# EAGLE design ATmega64M1_Dev_Board (EAGLE 9.1.1)
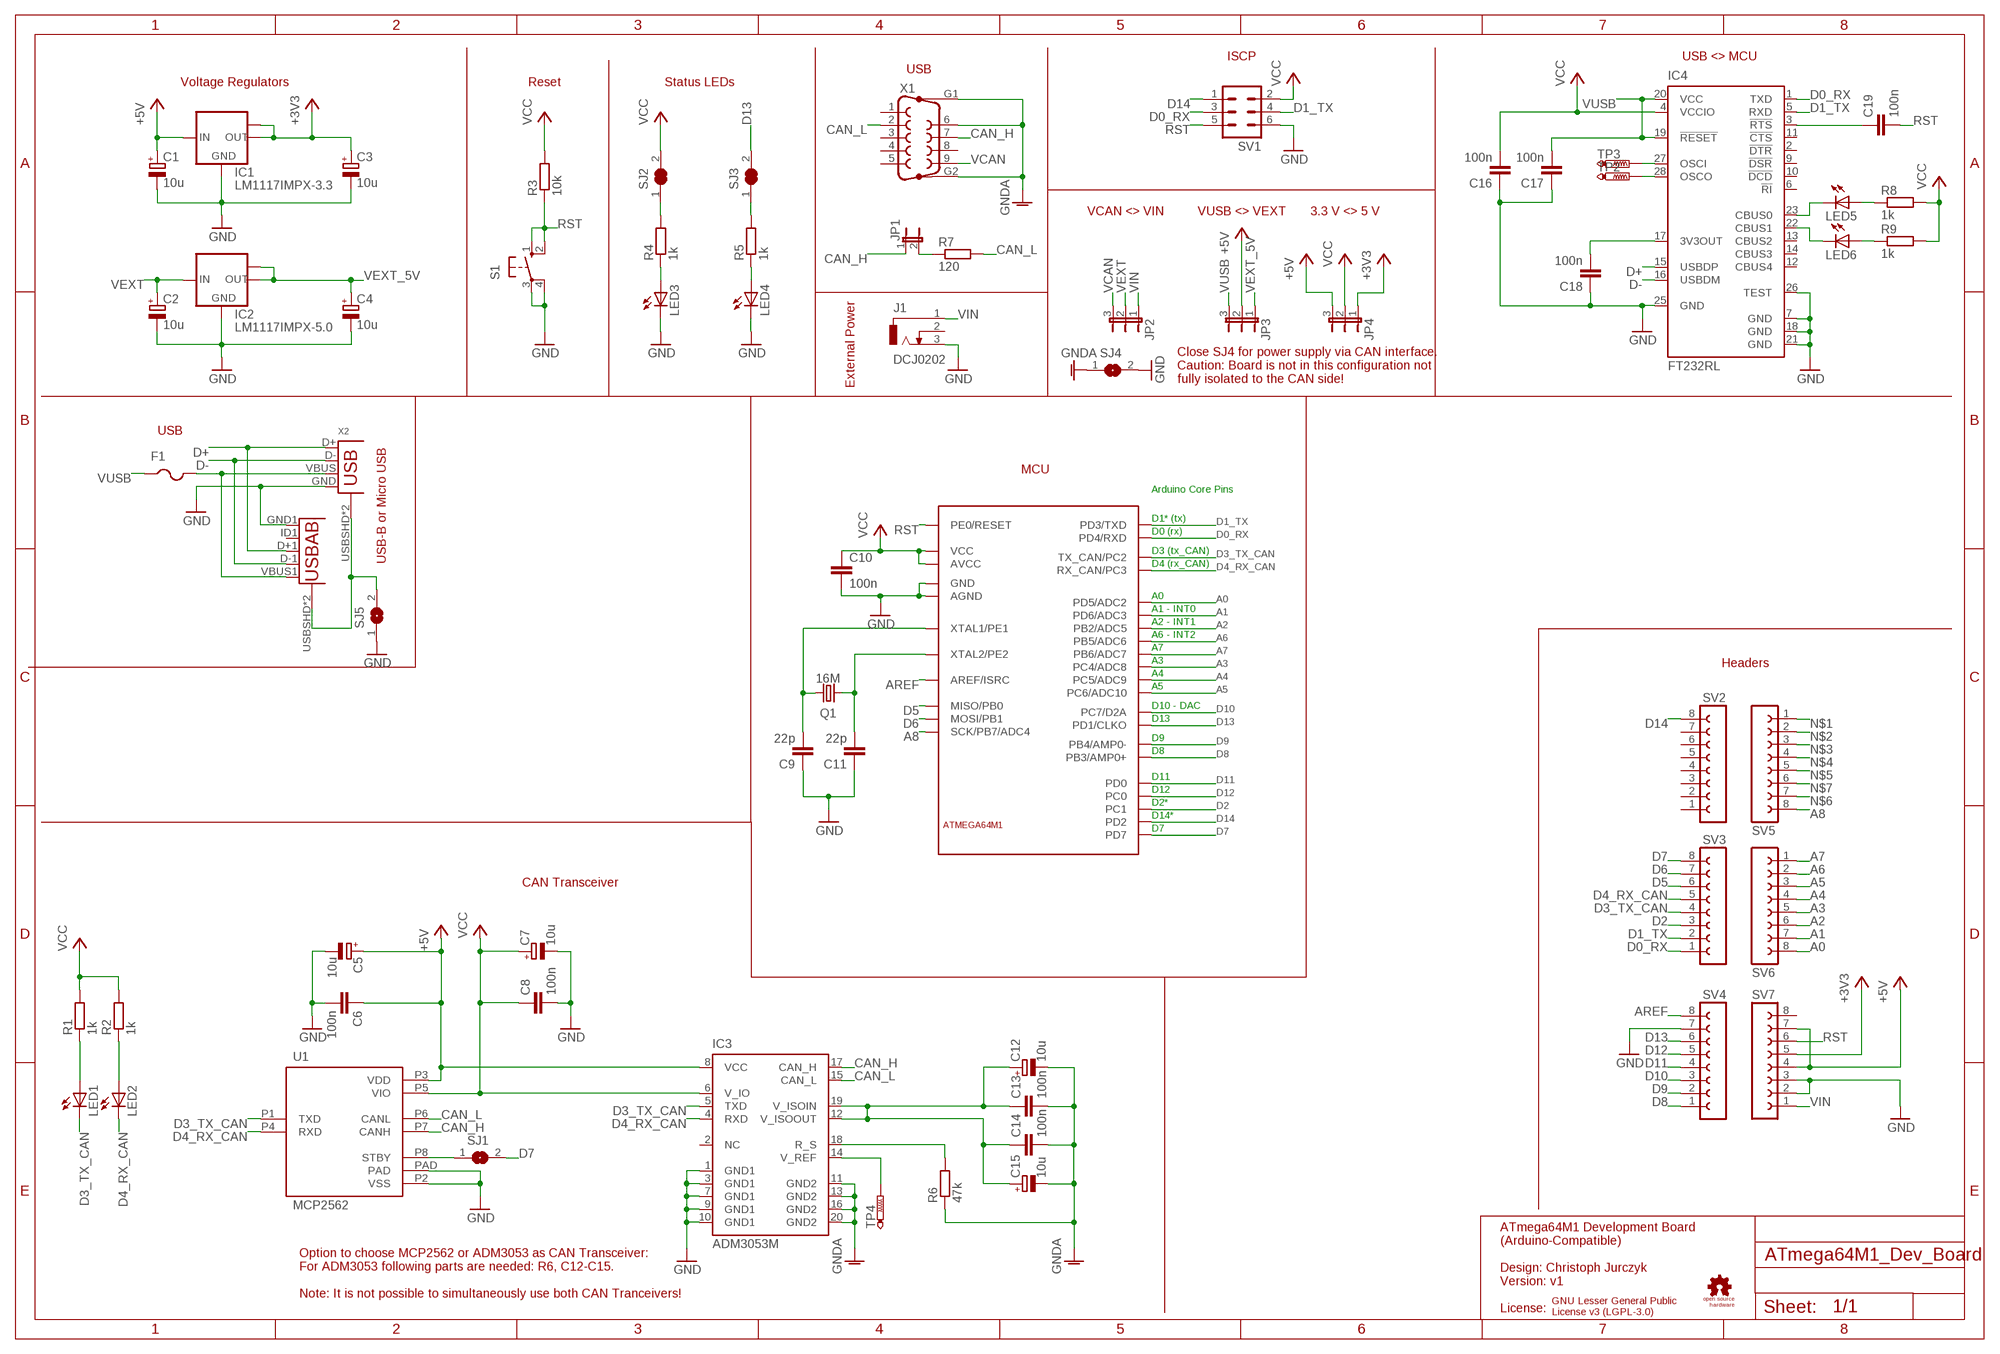
[diagram p0: schematic, sheet 1]

## Parts
C1  10u  CPOL-EUA/3216-18W  [A/3216-18W]
C2  10u  CPOL-EUA/3216-18W  [A/3216-18W]
C3  10u  CPOL-EUA/3216-18W  [A/3216-18W]
C4  10u  CPOL-EUA/3216-18W  [A/3216-18W]
C5  10u  CPOL-EUA/3216-18W  [A/3216-18W]
C6  100n  C-EUC0603  [C0603]
C7  10u  CPOL-EUA/3216-18W  [A/3216-18W]
C8  100n  C-EUC0603  [C0603]
C9  22p  C-EUC0603  [C0603]
C10  100n  C-EUC0603  [C0603]
C11  22p  C-EUC0603  [C0603]
C12  10u  CPOL-EUA/3216-18W  [A/3216-18W]
C13  100n  C-EUC0603  [C0603]
C14  100n  C-EUC0603  [C0603]
C15  10u  CPOL-EUA/3216-18W  [A/3216-18W]
C16  100n  C-EUC0603  [C0603]
C17  100n  C-EUC0603  [C0603]
C18  100n  C-EUC0603  [C0603]
C19  100n  C-EUC0603  [C0603]
F1  PTCFUSE-1206  [R1206]
GOLD_ORB_SM1  OSHWLOGOLOGO8MM  [OSHW_8MM]
IC1  LM1117IMPX-3.3  [SOT223]
IC2  LM1117IMPX-5.0  [SOT223]
IC3  ADM3053M  [SO20W]
IC4  FT232RL  [SSOP28]
IC11  ATMEGA64M1TQFP32  [QFP-32]
J1  DCJ0202  [DCJ0202]
JP1  JP1E  [JP1]
JP2  JP2E  [JP2]
JP3  JP2E  [JP2]
JP4  JP2E  [JP2]
LED1  LEDSML0805  [SML0805]
LED2  LEDSML0805  [SML0805]
LED3  LEDSML0805  [SML0805]
LED4  LEDSML0805  [SML0805]
LED5  LEDSML0805  [SML0805]
LED6  LEDSML0805  [SML0805]
Q1  16M  CRYSTALHC49S  [HC49/S]
R1  1k  R-EU_M0805  [M0805]
R2  1k  R-EU_M0805  [M0805]
R3  10k  R-EU_M0805  [M0805]
R4  1k  R-EU_M0805  [M0805]
R5  1k  R-EU_M0805  [M0805]
R6  47k  R-EU_M0805  [M0805]
R7  120  R-EU_M0805  [M0805]
R8  1k  R-EU_M0805  [M0805]
R9  1k  R-EU_M0805  [M0805]
S1  10-XX  [B3F-10XX]
SJ1  SJ  [SJ]
SJ2  SJ_NC  [SJ_NC]
SJ3  SJ_NC  [SJ_NC]
SJ4  SJ  [SJ]
SJ5  SJ  [SJ]
SV1  ML6  [ML6]
SV2  FE08-1  [FE08]
SV3  FE08-1  [FE08]
SV4  FE08-1  [FE08]
SV5  FE08-1  [FE08]
SV6  FE08-1  [FE08]
SV7  FE08-1  [FE08]
TP2  PTR1B1,27  [B1,27]
TP3  PTR1B1,27  [B1,27]
TP4  PTR1B1,27  [B1,27]
U1  MCP2562  [DFN3X3]
U2  USB  [USB-MICRO-SMD_WITHOUT_PASTE]
X1  F09HP  [F09HP]
X2  USB-B-H  [USB-B-H]

## Nets
+3V3: C3.+ IC1.2(OUT) IC1.TAB(OUT1) JP4.1 SV7.5
+5V: C1.+ C5.+ C6.1 IC1.3(IN) IC3.8(VCC) JP3.2 JP4.3 SV7.4 SV7.7 U1.P3(VDD)
A0: IC11.13(PD5/ADC2) SV6.8
A1: IC11.14(PD6/ADC3) SV6.7
A2: IC11.16(PB2/ADC5) SV6.6
A3: IC11.17(PC4/ADC8) SV6.5
A4: IC11.18(PC5/ADC9) SV6.4
A5: IC11.22(PC6/ADC10) SV6.3
A6: IC11.26(PB5/ADC6) SV6.2
A7: IC11.27(PB6/ADC7) SV6.1
A8: IC11.28(SCK/PB7/ADC4) SV5.8
AREF: IC11.21(AREF/ISRC) SV4.8
CAN_H: IC3.17(CAN_H) JP1.1 U1.P7(CANH) X1.7
CAN_L: IC3.15(CAN_L) R7.2 U1.P6(CANL) X1.2
D0_RX: IC4.1(TXD) IC11.12(PD4/RXD) SV1.3 SV3.1
D1_TX: IC4.5(RXD) IC11.2(PD3/TXD) SV1.4 SV3.2
D2: IC11.3(PC1) SV3.3
D3_TX_CAN: IC3.5(TXD) IC11.6(TX_CAN/PC2) LED1.C SV3.4 U1.P1(TXD)
D4_RX_CAN: IC3.4(RXD) IC11.7(RX_CAN/PC3) LED2.C SV3.5 U1.P4(RXD)
D5: IC11.8(MISO/PB0) SV3.6
D6: IC11.9(MOSI/PB1) SV3.7
D7: IC11.15(PD7) SJ1.2 SV3.8
D8: IC11.23(PB3/AMP0+) SV4.1
D9: IC11.24(PB4/AMP0-) SV4.2
D10: IC11.25(PC7/D2A) SV4.3
D11: IC11.29(PD0) SV4.4
D12: IC11.30(PC0) SV4.5
D13: IC11.32(PD1/CLKO) SJ3.2 SV4.6
D14: IC11.1(PD2) SV1.1 SV2.8
D+: IC4.15(USBDP) U2.D+1(D+) X2.D+
D-: IC4.16(USBDM) U2.D-1(D-) X2.D-
GND: C1.- C2.- C3.- C4.- C5.- C6.2 C7.- C8.2 C9.1 C10.2 C11.1 C16.1 C17.1 C18.1 IC1.1(GND) IC2.1(GND) IC3.1(GND1) IC3.3(GND1) IC3.7(GND1) IC3.9(GND1) IC3.10(GND1) IC4.7(GND) IC4.18(GND) IC4.21(GND) IC4.25(GND) IC4.26(TEST) IC11.5(GND) IC11.20(AGND) J1.3 LED3.C LED4.C S1.3(P) S1.4(P1) SJ4.2 SJ5.1 SV1.6 SV4.7 SV7.2 SV7.3 U1.P2(VSS) U1.PAD U2.GND1(GND) X2.GND
GNDA: C12.- C13.2 C14.2 C15.- IC3.11(GND2) IC3.13(GND2) IC3.16(GND2) IC3.20(GND2) R6.1 SJ4.1 X1.6 X1.G1 X1.G2
N$1: SV5.1
N$2: SV5.2
N$3: SV5.3
N$4: SV5.4
N$5: SV5.5
N$6: SV5.7
N$7: SV5.6
N$8: F1.2 U2.VBUS1(VBUS) X2.VBUS
N$9: SJ1.1 U1.P8(STBY)
N$10: C12.+ C13.1 C14.1 C15.+ IC3.12(V_ISOOUT) IC3.19(V_ISOIN)
N$11: IC4.27(OSCI) TP3.TP
N$12: C18.2 IC4.17(3V3OUT)
N$13: IC3.18(R_S) R6.2
N$14: IC4.28(OSCO) TP2.TP
N$15: C19.1 IC4.3(!RTS)
N$16: IC4.22(CBUS1) LED6.C
N$17: IC4.23(CBUS0) LED5.C
N$18: LED6.A R9.1
N$19: LED5.A R8.1
N$20: JP1.2 R7.1
N$21: LED3.A R4.1
N$22: LED4.A R5.1
N$23: LED2.A R2.1
N$24: LED1.A R1.1
N$25: IC3.14(V_REF) TP4.TP
N$26: R5.2 SJ3.1
N$27: R4.2 SJ2.1
N$28: SJ5.2 U2.USBSHD U2.USBSHD1(USBSHD) X2.USBSHD X2.USBSHD2(USBSHD)
RST: C19.2 IC11.31(PE0/RESET) R3.1 S1.1(S) S1.2(S1) SV1.5 SV7.6
VCAN: JP2.3 X1.9
VCC: C7.+ C8.1 C10.1 C16.2 IC3.6(V_IO) IC4.4(VCCIO) IC11.4(VCC) IC11.19(AVCC) JP4.2 R1.2 R2.2 R3.2 R8.2 R9.2 SJ2.2 SV1.2 U1.P5(VIO)
VEXT: C2.+ IC2.3(IN) JP2.2
VEXT_5V: C4.+ IC2.2(OUT) IC2.TAB(OUT1) JP3.1
VIN: J1.1 JP2.1 SV7.1
VUSB: C17.2 F1.1 IC4.19(!RESET) IC4.20(VCC) JP3.3
XTAL1: C9.2 IC11.10(XTAL1/PE1) Q1.2
XTAL2: C11.2 IC11.11(XTAL2/PE2) Q1.1
Unconnected: IC3.2(NC) IC4.2(!DTR) IC4.6(!RI) IC4.9(!DSR) IC4.10(!DCD) IC4.11(!CTS) IC4.12(CBUS4) IC4.13(CBUS2) IC4.14(CBUS3) J1.2 SV2.1 SV2.2 SV2.3 SV2.4 SV2.5 SV2.6 SV2.7 SV7.8 U2.ID1(USBID) X1.1 X1.3 X1.4 X1.5 X1.8

## Notes on the sheet
- ISCP | USB <> MCU
- USB
- Voltage Regulators | Reset | Status LEDs
- VCAN <> VIN | VUSB <> VEXT | 3.3 V <> 5 V
- External Power
- Close SJ4 for power supply via CAN interface.
  Caution: Board is not in this configuration not 
  fully isolated to the CAN side!
- USB
- MCU
- Arduino Core Pins
- D1* (tx)
- D0 (rx)
- D3 (tx_CAN)
- USB-B or Micro USB
- D4 (rx_CAN)
- A0
- A1 - INT0
- A2 - INT1
- A6 - INT2
- A7
- A3
- Headers
- A4
- A5
- D10 - DAC
- D13
- D9
- D8
- D11
- D12
- D2*
- D14*
- D7
- CAN Transceiver
- ATmega64M1 Development Board 
  (Arduino-Compatible)
  
  Design: Christoph Jurczyk
  Version: v1
  
  License:
- Option to choose MCP2562 or ADM3053 as CAN Transceiver:
  For ADM3053 following parts are needed: R6, C12-C15.
  
  Note: It is not possible to simultaneously use both CAN Tranceivers!
- GNU Lesser General Public 
  License v3 (LGPL-3.0)

## Library data of the parts
C1-C5 C7 C12 C15 = rcl:CPOL-EU: POLARIZED CAPACITOR, European symbol; SPICEPREFIX: C
C6 C8-C11 C13 C14 C16-C19 = rcl:C-EU: CAPACITOR, European symbol; SPICEPREFIX: C
F1 = adafruit:PTCFUSE: PTC fuses, resettable thermistors
GOLD_ORB_SM1 = oshw:OSHWLOGO: The OSHW logo for PCB layout
IC1 IC2 = lm1117:LM1117IMPX-*
IC3 = ADM3053:ADM3053: Signal and Power Isolated CAN Transceiver Analog Devices - Signal and Power Isolated CAN Transceiver with Integrated Isolated DC-to-DC Converter
IC4 = ftdichip:FT232R: Source: http://www.ftdichip.com/Documents/DataSheets/DS_FT232R_v104.pdf; MPN: FT232RL; OC_FARNELL: 1146032; OC_NEWARK: 91K9918
IC11 = ATmega64M1:ATMEGA64M1
J1 = con-jack:DCJ0202: DC POWER JACK Source: DCJ0202.pdf; OC_FARNELL: unknown; OC_NEWARK: unknown
JP1 = jumper:JP1E: JUMPER
JP2-JP4 = CJ_Library:JP2E: JUMPER
LED1-LED6 = led:LED: LED OSRAM: - CHIPLED LG R971, LG N971, LY N971, LG Q971, LY Q971, LO R971, LY R971 LH N974, LH R974 LS Q976, LO Q976, LY Q976 LO Q996 - Hyper CHIPLED LW Q18S LB Q993, LB Q99A, LB R99A - SideLED LS A670, LO A670, LY A670, LG A670, LP A670 LB A673, LV A673, LT A673, LW A673 LH A674 LY A675 LS A676, LA A676, LO A676, LY A676, LW A676 LS A679, LY A679, LG A679 - Hyper Micro SIDELED® LS Y876, LA Y876, LO Y876, LY Y876 LT Y87S - SmartLED LW L88C, LW L88S LB L89C, LB L89S, LG L890 LS L89K, LO L89K, LY L89K LS L896, LA L896, LO L896, LY L896 - TOPLED LS T670, LO T670, LY T670, LG T670, LP T670 LSG T670, LSP T670, LSY T670, LOP T670, LYG T670 LG T671, LOG T671, LSG T671 LB T673, LV T673, LT T673, LW T673 LH T674 LS T676, LA T676, LO T676, LY T676, LB T676, LH T676, LSB T676, LW T676 LB T67C, LV T67C, LT T67C, LS T67K, LO T67K, LY T67K, LW E67C LS E67B, LA E67B, LO E67B, LY E67B, LB E67C, LV E67C, LT E67C LW T67C LS T679, LY T679, LG T679 LS T770, LO T770, LY T770, LG T770, LP T770 LB T773, LV T773, LT T773, LW T773 LH T774 LS E675, LA E675, LY E675, LS T675 LS T776, LA T776, LO T776, LY T776, LB T776 LHGB T686 LT T68C, LB T68C - Hyper Mini TOPLED® LB M676 - Mini TOPLED Santana® LG M470 LS M47K, LO M47K, LY M47K Source: http://www.osram.convergy.de LUXEON: - LUMILED® LXK2-PW12-R00, LXK2-PW12-S00, LXK2-PW14-U00, LXK2-PW14-V00 LXK2-PM12-R00, LXK2-PM12-S00, LXK2-PM14-U00 LXK2-PE12-Q00, LXK2-PE12-R00, LXK2-PE12-S00, LXK2-PE14-T00, LXK2-PE14-U00 LXK2-PB12-K00, LXK2-PB12-L00, LXK2-PB12-M00, LXK2-PB14-N00, LXK2-PB14-P00, LXK2-PB14-Q00 LXK2-PR12-L00, LXK2-PR12-M00, LXK2-PR14-Q00, LXK2-PR14-R00 LXK2-PD12-Q00, LXK2-PD12-R00, LXK2-PD12-S00 LXK2-PH12-R00, LXK2-PH12-S00 LXK2-PL12-P00, LXK2-PL12-Q00, LXK2-PL12-R00 Source: www.luxeon.com KINGBRIGHT: KA-3528ASYC Source: www.kingbright.com
Q1 = crystal:CRYSTAL: CRYSTAL; OC_FARNELL: 1667008; OC_NEWARK: unknown
R1-R9 = rcl:R-EU_: RESISTOR, European symbol; SPICEPREFIX: R
S1 = switch-omron:10-XX: OMRON SWITCH; MPN: B3F-1000; OC_FARNELL: 176432; OC_NEWARK: 36M3542
SJ1 SJ4 SJ5 = jumper:SJ: SMD solder JUMPER
SJ2 SJ3 = CJ_Library:SJ_NC: SMD solder JUMPER
SV1 = con-harting-ml:ML6: HARTING; OC_FARNELL: unknown; OC_NEWARK: unknown
SV2-SV7 = CJ_Library:FE08-1: FEMALE HEADER; OC_FARNELL: unknown; OC_NEWARK: unknown
TP2-TP4 = testpad:PTR1: TEST PIN
U1 = can:MCP2562
U2 = MicroUSB:USB: This is a USB AB connector that is compatible with USB OTG. i.e. this connector can serve as a host or device
X1 = con-subd:F09HP: SUB-D; OC_FARNELL: unknown; OC_NEWARK: unknown
X2 = con-usb-3:USB: USB Connectors

## Board
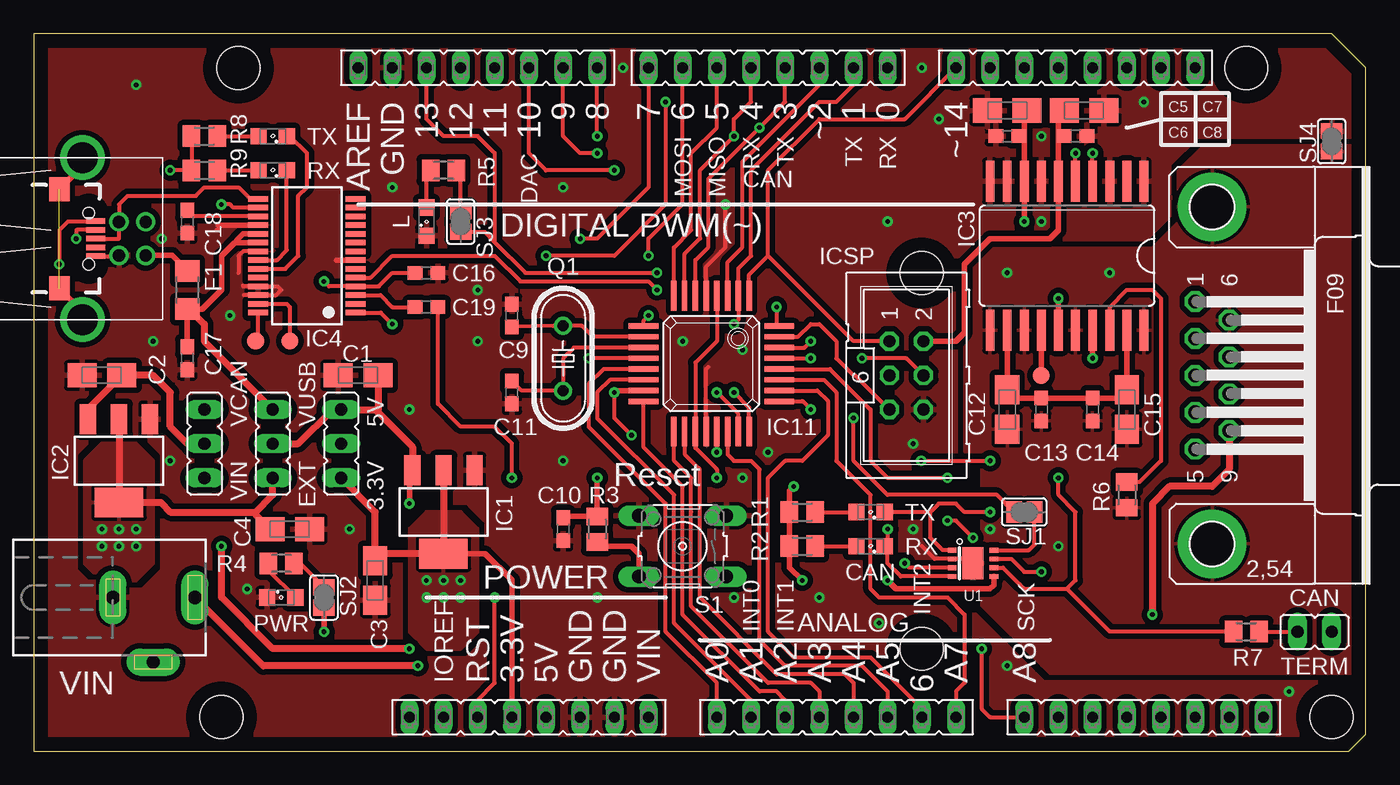
[diagram p1: board, top side]
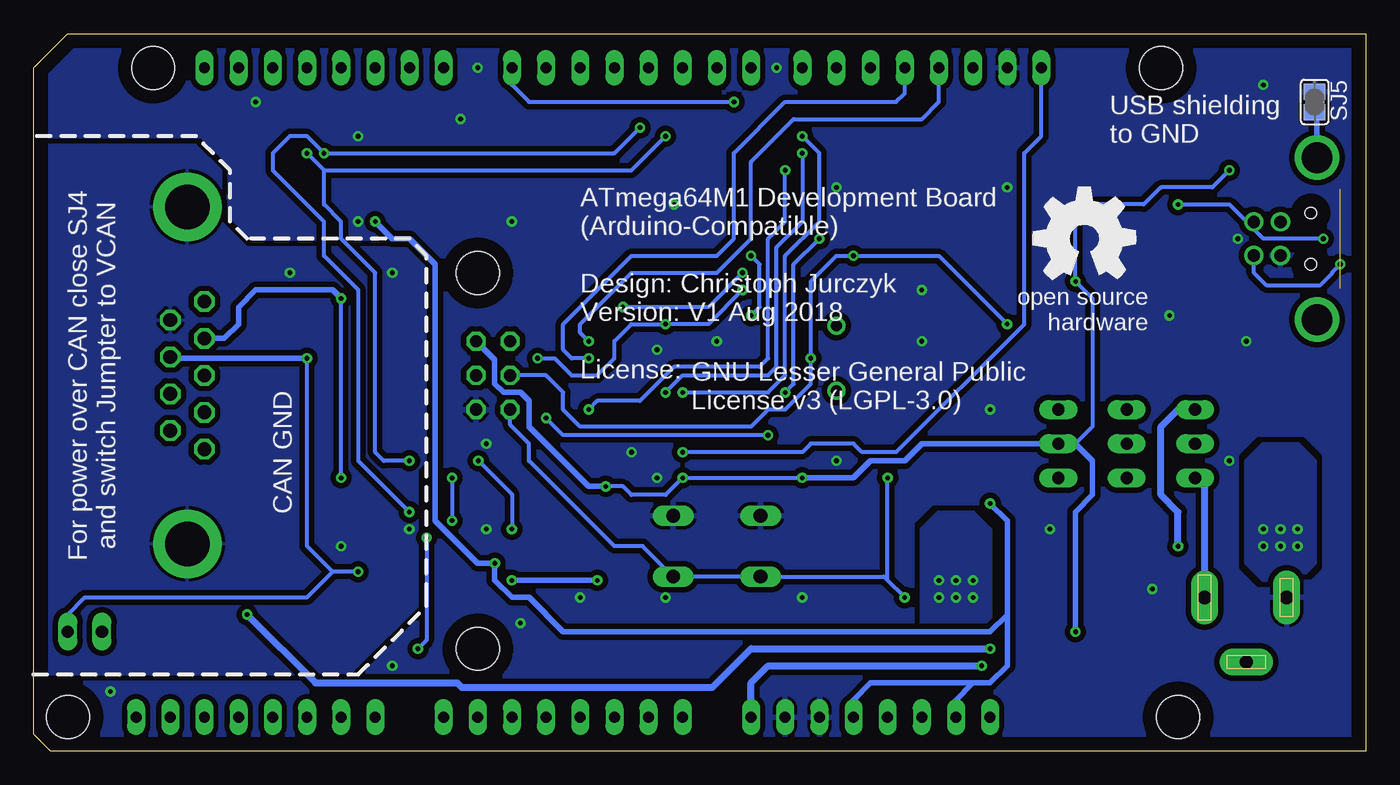
[diagram p2: board, bottom side, seen from below]

Size 99.06 x 53.34 mm. Coordinates in mm from the lower left corner, seen from the top.
Outline: 0,0 97.79,0 99.06,1.27 99.06,50.8 96.52,53.34 0,53.34 0,0
Copper layers (1*16): Top 0.035mm / dielectric 1.5mm / Bottom 0.035mm
Design rules "default *": minimum track width 6mil, minimum drill 0.35mm, track to track 3.5mil, track to pad 3.5mil, pad to pad 3.5mil, via to via 3.5mil, smd to smd 3.5mil, copper to edge 40mil, drill to drill 6mil, minimum pad ring 10mil, minimum via ring 8mil, stop-mask expansion 4mil, vias tented up to drill 13mil, thermal gap 10mil
Holes 3.2 mm at 90.17,50.8 96.52,2.54 66.04,35.56 66.04,7.62 15.24,50.8 13.97,2.54
tKeepout: area 12.2,47.8 to 18.2,53.8; area 11,-0.5 to 17,5.5; area 93.5,-0.5 to 99.5,5.5; area 87.2,47.8 to 93.2,53.8; area 63,32.6 to 69,38.6

### Footprints (pad centres in the part's own frame; a part is rotated, then mirrored left to right if it is on the bottom)
A/3216-18W = smd 2.15 x 1.8: + 1.475,0; - -1.475,0
C0603 = smd 1.1 x 1: 1 -0.85,0; 2 0.85,0
R1206 = smd 1.6 x 1.803: 1 -1.422,0; 2 1.422,0
SOT223 = smd 1.219 x 2.235: 1 -2.311,-3.099; 2 0,-3.099; 3 2.311,-3.099 | smd 3.6 x 2.2: TAB 0,3.099
SO20W = smd 0.66 x 3.032: 1 -5.715,-5.529; 2 -4.445,-5.529; 3 -3.175,-5.529; 4 -1.905,-5.529; 5 -0.635,-5.529; 6 0.635,-5.529; 7 1.905,-5.529; 8 3.175,-5.529; 9 4.445,-5.529; 10 5.715,-5.529; 11 5.715,5.529; 12 4.445,5.529; 13 3.175,5.529; 14 1.905,5.529; 15 0.635,5.529; 16 -0.635,5.529; 17 -1.905,5.529; 18 -3.175,5.529; 19 -4.445,5.529; 20 -5.715,5.529
SSOP28 = smd 0.4 x 1.5: 1 -4.225,-3.625; 2 -3.575,-3.625; 3 -2.925,-3.625; 4 -2.275,-3.625; 5 -1.625,-3.625; 6 -0.975,-3.625; 7 -0.325,-3.625; 8 0.325,-3.625; 9 0.975,-3.625; 10 1.625,-3.625; 11 2.275,-3.625; 12 2.925,-3.625; 13 3.575,-3.625; 14 4.225,-3.625; 15 4.225,3.625; 16 3.575,3.625; 17 2.925,3.625; 18 2.275,3.625; 19 1.625,3.625; 20 0.975,3.625; 21 0.325,3.625; 22 -0.325,3.625; 23 -0.975,3.625; 24 -1.625,3.625; 25 -2.275,3.625; 26 -2.925,3.625; 27 -3.575,3.625; 28 -4.225,3.625
QFP-32 = smd 0.4 x 2.2: 1 -2.4,-4.65; 2 -1.6,-4.65; 3 -0.8,-4.65; 4 0,-4.65; 5 0.8,-4.65; 6 1.6,-4.65; 7 2.4,-4.65; 8 3.2,-4.65; 17 3.2,5.45; 18 2.4,5.45; 19 1.6,5.45; 20 0.8,5.45; 21 0,5.45; 22 -0.8,5.45; 23 -1.6,5.45; 24 -2.4,5.45 | smd 2.2 x 0.4: 9 5.45,-2.4; 10 5.45,-1.6; 11 5.45,-0.8; 12 5.45,0; 13 5.45,0.8; 14 5.45,1.6; 15 5.45,2.4; 16 5.45,3.2; 25 -4.65,3.2; 26 -4.65,2.4; 27 -4.65,1.6; 28 -4.65,0.8; 29 -4.65,0; 30 -4.65,-0.8; 31 -4.65,-1.6; 32 -4.65,-2.4
DCJ0202 = drill 1 pad 2 long: 1 0,3.1; 2 4.8,0; 3 0,-3
JP1 = drill 0.914 long: 1 0,-1.27; 2 0,1.27
JP2 = drill 0.914 long: 1 -2.54,0; 2 0,0; 3 2.54,0
SML0805 = smd 1.2 x 1.2: A 1.05,0; C -1.05,0
HC49/S = drill 0.813: 1 -2.413,0; 2 2.413,0
M0805 = smd 1.3 x 1.6: 1 -0.95,0; 2 0.95,0
B3F-10XX = drill 1.016 long: 1 -3.251,2.261; 2 3.251,2.261; 3 -3.251,-2.261; 4 3.251,-2.261
SJ = smd 1.168 x 1.6: 1 -0.762,0; 2 0.762,0
SJ_NC = smd 1.168 x 1.6: 1 -0.762,0; 2 0.762,0
ML6 = drill 0.914 octagon: 1 -2.54,-1.27; 2 -2.54,1.27; 3 0,-1.27; 4 0,1.27; 5 2.54,-1.27; 6 2.54,1.27
FE08 = drill 0.813 long: 1 -8.89,0; 2 -6.35,0; 3 -3.81,0; 4 -1.27,0; 5 1.27,0; 6 3.81,0; 7 6.35,0; 8 8.89,0
B1,27 = smd 1.27 x 1.27: TP 0,0
DFN3X3 = smd 0.35 x 0.65: P1 -0.975,-1.55; P2 -0.325,-1.55; P3 0.325,-1.55; P4 0.975,-1.55; P5 0.975,1.55; P6 0.325,1.55; P7 -0.325,1.55; P8 -0.975,1.55 | smd 2.4 x 1.55: PAD 0,0
USB-MICRO-SMD_WITHOUT_PASTE = smd 1.4 x 0.4: D+1 2.7,0; D-1 2.7,0.65; GND1 2.7,-1.3; ID1 2.7,-0.65; VBUS1 2.7,1.3 | smd 1.524 x 1.778: USBSHD 0,3.683; USBSHD1 0,-3.683 | hole 0.85: 2.2,1.9; 2.2,-1.9
F09HP = drill 1.016 octagon: 1 -5.486,-1.27; 2 -2.743,-1.27; 3 0,-1.27; 4 2.743,-1.27; 5 5.486,-1.27; 6 -4.115,1.27; 7 -1.372,1.27; 8 1.372,1.27; 9 4.115,1.27 | drill 3.302 pad 5.08: G1 -12.522,0; G2 12.522,0
USB-B-H = drill 0.914: D+ 0,1.25; D- 1.981,1.25; GND 0,-1.25; VBUS 1.981,-1.25 | drill 2.286: USBSHD -2.718,6.02; USBSHD2 -2.718,-6.02

### Placement (x,y rotation side)
C1  24.13,27.94 0 top
C2  5.08,27.94 0 top
C3  25.4,12.7 90 top
C4  19.05,16.51 180 top
C5  72.39,47.62 0 top
C6  72.39,45.72 180 top
C7  78.11,47.62 180 top
C8  77.47,45.72 0 top
C9  35.56,32.38 270 top
C10  39.37,16.51 270 top
C11  35.56,26.67 90 top
C12  72.39,25.4 90 top
C13  74.93,25.4 270 top
C14  78.74,25.4 270 top
C15  81.28,25.4 90 top
C16  29.21,35.56 180 top
C17  11.43,29.21 90 top
C18  11.43,39.37 90 top
C19  29.21,33.02 0 top
F1  11.43,34.29 90 top
GOLD_ORB_SM1  20.95,38.1 0 bottom
IC1  30.48,17.78 180 top
IC2  6.35,21.59 180 top
IC3  76.83,36.83 180 top
IC4  20.32,36.83 90 top
IC11  50.8,29.21 180 top
J1  8.89,11.43 270 top
JP1  95.25,8.89 90 top
JP2  12.7,22.86 90 top
JP3  17.78,22.86 90 top
JP4  22.86,22.86 90 top
LED1  62.23,17.78 180 top
LED2  62.23,15.24 180 top
LED3  18.41,11.43 0 top
LED4  29.21,39.37 90 top
LED5  17.78,45.72 180 top
LED6  17.78,43.18 180 top
Q1  39.37,29.21 90 top
R1  57.15,17.78 180 top
R2  57.15,15.24 180 top
R3  41.91,16.51 90 top
R4  18.41,13.97 0 top
R5  30.48,43.18 0 top
R6  81.28,19.05 90 top
R7  90.17,8.89 180 top
R8  12.7,45.72 180 top
R9  12.7,43.18 180 top
S1  48.26,15.24 180 top
SJ1  73.66,17.78 180 top
SJ2  21.59,11.43 270 top
SJ3  31.75,39.37 270 top
SJ4  96.52,45.34 90 top
SJ5  3.81,48.26 270 bottom
SV1  64.9,27.94 270 top
SV2  77.47,50.8 180 top
SV3  54.61,50.8 180 top
SV4  33.02,50.8 180 top
SV5  82.55,2.54 180 top
SV6  59.69,2.54 180 top
SV7  36.83,2.54 180 top
TP2  16.51,30.48 0 top
TP3  19.05,30.48 0 top
TP4  74.93,27.94 0 top
U1  69.85,13.97 270 top
U2  1.91,38.1 0 top
X1  87.63,27.94 270 top
X2  6.35,38.1 0 top

### Tracks (layer width: path | path; a pad name or v marks a point on that pad's centre or on a via)
+3V3  (via drill 0.35)
  Top 0.406: SV7.5 35.56,12.7 33.58,14.68 IC1.TAB
  Top 0.508: IC1.2 IC1.TAB 25.91,14.68 C3.+ 25.4,17.78 JP4.1
  other vias: 29.21,12.7 30.48,12.7 31.75,12.7 31.75,11.43 30.48,11.43 29.21,11.43
  pour Top (isolate 0.406): 27.94,16.51 27.94,8.89 29.21,7.62 31.75,7.62 33.02,8.89 33.02,16.51 31.75,17.78 29.21,17.78
  pour Bottom (isolate 0.406): 27.94,16.51 27.94,8.89 29.21,7.62 31.75,7.62 33.02,8.89 33.02,16.51 31.75,17.78 29.21,17.78
+5V  (via drill 0.35)
  Top 0.305: U1.P3 65.09,13.64 v64.77,13.97
  Top 0.406: 73.66,45.72 IC3.8 v73.66,39.37 | 73.66,45.72 73.66,47.42 C5.+ | C6.1 73.66,45.72 | v27.94,18.41 27.94,20.65 IC1.3
  Top 0.508: JP3.2 19.68,22.86 22.23,25.4 JP4.3 25.4,25.4 25.61,25.2 | IC1.3 28.17,22.63 25.61,25.2 | C1.+ 25.61,25.2
  Bottom 0.406: SV7.4 38.1,3.81 36.83,5.08 29.21,5.08 | 26.67,10.16 26.67,17.14 v27.94,18.41 | v73.66,39.37 72.39,38.1 71.12,38.1 69.22,36.2 69.22,17.14 66.04,13.97 v64.77,13.97 64.77,12.7 63.5,11.43 62.23,11.43 59.69,8.89 27.94,8.89 26.67,10.16 | 29.21,5.08 27.94,5.08 26.67,6.35 26.67,10.16 | SV7.7 30.48,3.81 29.21,5.08
A0
  Top 0.305: SV6.8 50.8,5.08 46.99,8.89 46.99,18.41 41.27,24.13 41.27,27.3 42.38,28.41 IC11.13
A1
  Top 0.305: SV6.7 53.34,3.81 47.62,9.53 47.62,19.05 41.91,24.77 41.91,26.67 42.85,27.61 IC11.14
A2
  Top 0.305: SV6.6 55.88,3.81 55.24,4.45 53.98,4.45 48.26,10.16 48.26,19.68 45.35,22.59 IC11.16
A3
  Top 0.305: SV6.5 58.42,4.45 57.78,5.08 54.61,5.08 48.9,10.79 48.9,17.78 48.9,20.32 47.62,21.59 47.62,23.73 IC11.17
A4
  Top 0.305: SV6.4 60.96,5.08 60.33,5.71 55.24,5.71 49.53,11.43 49.53,20.95 49.21,21.27 48.9,21.59 48.4,22.09 IC11.18
A5
  Top 0.305: SV6.3 63.5,4.45 61.59,6.35 55.88,6.35 53.98,8.26 53.98,20.95 53.34,21.59 52.07,21.59 51.6,22.06 IC11.22
A6
  Top 0.305: SV6.2 66.04,3.17 62.23,6.99 56.52,6.99 54.61,8.89 54.61,20.32 55.88,21.59 57.15,21.59 59.05,23.5 59.05,26.04 58.28,26.81 IC11.26
A7
  Top 0.305: SV6.1 68.58,4.45 69.22,5.08 69.22,10.16 67.94,11.43 62.87,11.43 62.23,12.06 62.23,19.05 59.69,21.59 59.69,26.67 58.75,27.61 IC11.27
A8  (via drill 0.35)
  Top 0.305: v67.94,17.14 68.58,17.14 v69.85,15.88 | v70.48,7.62 70.48,3.17 71.12,2.54 SV5.8 | IC11.28 59.22,28.41 62.23,25.4 62.23,21.59 63.5,20.32 v67.94,20.32
  Bottom 0.305: v70.48,7.62 69.85,8.26 v69.85,15.88 | v67.94,20.32 v67.94,17.14
AREF  (via drill 0.35)
  Top 0.305: v50.8,22.23 IC11.21
  Bottom 0.305: SV4.8 24.13,45.72 25.4,44.45 25.4,31.75 34.92,22.23 37.47,22.23 38.1,22.86 41.27,22.86 41.91,22.23 v50.8,22.23
CAN_H  (via drill 0.35)
  Top 0.305: U1.P7 72.7,14.29 73.66,13.34 v74.93,13.34
  Top 0.406: IC3.17 v78.74,29.21
  Bottom 0.305: v74.93,13.34 76.83,13.34 | v78.74,29.21 78.74,15.24 76.83,13.34 | JP1.1 96.52,10.16 95.25,11.43 78.74,11.43 76.83,13.34
  Bottom 0.406: v78.74,29.21 88.8,29.21 X1.7
CAN_L  (via drill 0.35)
  Top 0.305: U1.P6 72.08,13.64 73.34,12.38 73.66,12.06 76.83,12.06 | 76.83,12.06 77.47,12.7 77.47,17.78 76.2,19.05 v76.2,20.32 | R7.2 80.01,8.89 76.83,12.06
  Top 0.406: IC3.15 v76.2,33.66
  Bottom 0.305: v76.2,20.32 v76.2,33.66
  Bottom 0.406: v76.2,33.66 76.83,34.29 78.74,34.29 82.55,34.29 83.82,33.02 83.82,31.75 84.89,30.68 X1.2
D0_RX  (via drill 0.35)
  Top 0.305: v46.99,48.26 46.99,40.64 43.18,36.83 v38.1,36.83 | IC4.1 25.82,32.6 v26.67,31.75 | IC11.12 v41.27,29.21
  Bottom 0.305: SV3.1 63.5,49.53 62.23,48.26 v46.99,48.26 | v26.67,31.75 31.75,36.83 v38.1,36.83 39.37,36.83 41.27,34.92 v41.27,29.21 41.27,27.3 43.18,25.4 44.45,25.4 45.72,24.13 58.42,24.13 59.69,25.4 59.69,26.67 60.96,27.94 SV1.3
D1_TX  (via drill 0.35)
  Top 0.305: SV3.2 60.96,49.53 59.69,48.26 58.42,48.26 53.34,43.18 53.34,36.83 52.4,35.89 IC11.2 52.4,32.08 v52.07,31.75 | IC4.5 25.05,35.2 26.67,36.83 34.29,36.83 36.2,34.92 45.72,34.92 v46.35,34.29 | SV1.4 64.9,29.21 v61.59,29.21
  Bottom 0.305: v46.35,34.29 48.9,31.75 v52.07,31.75 54.61,31.75 55.88,30.48 55.88,29.21 57.15,27.94 59.05,27.94 60.33,29.21 v61.59,29.21
D2
  Top 0.305: SV3.3 58.42,49.53 52.7,43.81 52.7,37.47 51.6,36.36 IC11.3
D3_TX_CAN  (via drill 0.35)
  Top 0.305: U1.P1 67.61,14.95 66.67,15.88 66.67,17.78 | SV3.4 55.88,48.26 v53.98,46.35 50.16,42.55 50.16,37.47 49.2,36.5 IC11.6 | IC3.5 v77.47,44.45 | v71.12,17.78 69.22,17.78 68.58,18.41 67.31,18.41 66.67,17.78 | 66.67,17.78 LED1.C
  Bottom 0.305: v71.12,17.78 74.93,21.59 74.93,34.29 77.47,36.83 77.47,39.37 81.28,43.18 81.28,44.45 80.01,45.72 78.74,45.72 v77.47,44.45 55.88,44.45 v53.98,46.35
D4_RX_CAN  (via drill 0.35)
  Top 0.305: 63.5,15.24 LED2.C | IC3.4 v78.74,44.45 | v65.99,21.59 v71.12,21.59 | U1.P4 64.47,12.99 63.5,13.97 63.5,15.24 | v63.5,16.51 63.5,15.24 | IC11.7 48.4,36.97 49.55,38.12 49.55,43.2 v52.07,45.72 52.07,46.99 53.34,48.26 SV3.5
  Bottom 0.305: v78.74,44.45 77.47,43.18 | 77.47,43.18 54.61,43.18 v52.07,45.72 | v71.12,21.59 73.03,21.59 73.66,22.23 73.66,35.56 76.2,38.1 76.2,39.37 77.47,40.64 77.47,43.18 | v65.99,21.59 63.5,19.1 v63.5,16.51
D5
  Top 0.305: SV3.6 50.8,46.35 48.9,44.45 48.9,38.73 47.6,37.44 IC11.8
D6  (via drill 0.35)
  Top 0.305: IC11.9 45.35,32.02 v45.72,32.38 | v45.72,36.83 45.72,38.1 48.26,40.64 SV3.7
  Bottom 0.305: v45.72,32.38 45.09,33.02 45.09,36.2 v45.72,36.83
D7  (via drill 0.35)
  Top 0.305: SV3.8 45.72,41.91 41.91,38.1 v40.64,38.1 | SJ1.2 71.63,19.05 63.5,19.05 60.96,21.59 v60.96,24.77 | v44.45,23.5 43.18,24.77 v43.18,26.67
  Top 0.406: IC11.15 43.32,26.81 v43.18,26.67
  Bottom 0.305: v40.64,38.1 42.55,36.2 42.55,27.3 v43.18,26.67 | v60.96,24.77 59.69,23.5 v44.45,23.5
D8  (via drill 0.35)
  Top 0.305: v41.91,45.72 SV4.1 | IC11.23 52.4,25.07 v50.8,26.67
  Bottom 0.305: v41.91,45.72 40.64,44.45 40.64,39.37 43.18,36.83 43.18,27.94 44.45,26.67 v50.8,26.67
D9  (via drill 0.35)
  Top 0.305: v41.91,44.45 40.64,44.45 39.37,45.72 SV4.2 | IC11.24 53.2,25.54 v52.07,26.67
  Bottom 0.305: v41.91,44.45 41.91,39.37 43.81,37.47 43.81,28.57 44.45,27.94 50.8,27.94 v52.07,26.67
D10  (via drill 0.35)
  Top 0.305: v43.18,43.18 38.1,43.18 36.83,44.45 SV4.3 | IC11.25 57.12,26.01 57.15,26.04 v57.78,25.4
  Bottom 0.305: v43.18,43.18 43.18,39.37 44.45,38.1 44.45,29.21 45.09,28.57 51.44,28.57 53.98,26.04 57.15,26.04 v57.78,25.4
D11  (via drill 0.35)
  Top 0.305: IC11.29 v57.78,29.21
  Bottom 0.305: SV4.4 34.29,48.9 34.92,48.26 43.18,48.26 46.99,44.45 46.99,38.1 48.26,36.83 54.61,36.83 59.69,31.75 59.69,29.84 59.05,29.21 v57.78,29.21
D12  (via drill 0.35)
  Top 0.305: IC11.30 57.31,30.01 v57.78,30.48
  Bottom 0.305: SV4.5 31.75,48.26 33.02,46.99 42.55,46.99 45.72,43.81 45.72,38.1 48.26,35.56 54.61,35.56 58.42,31.75 58.42,31.11 v57.78,30.48
D13  (via drill 0.35)
  Top 0.305: SJ3.2 33.53,38.61 34.29,37.85 | SV4.6 29.21,46.99 30.48,45.72 33.02,45.72 34.29,44.45 34.29,37.85 | 34.29,37.85 36.58,35.56 v46.35,35.56 | v55.24,33.02 55.24,31.82 IC11.32
  Bottom 0.305: v46.35,35.56 48.9,33.02 v55.24,33.02
D14
  Top 0.305: IC11.1 53.2,35.42 54.61,36.83 | 54.61,36.83 54.61,43.18 58.42,46.99 64.77,46.99 SV2.8 | SV1.1 60.96,30.48 54.61,36.83
D+
  Top 0.305: 6.35,39.37 6.35,40.64 6.99,41.27 12.06,41.27 12.7,41.91 15.24,41.91 16.09,41.05 IC4.15 | 6.35,39.37 X2.D+ | U2.D+1 6.35,38.1 6.35,39.37
D-  (via drill 0.35)
  Top 0.305: IC4.16 14.84,40.41 14.61,40.64 v13.97,40.64 | U2.D-1 3.19,38.75 3.17,38.73 v3.17,38.1
  Bottom 0.305: v13.97,40.64 10.16,40.64 8.87,39.35 X2.D- 8.33,38.81 7.62,38.1 v3.17,38.1
GND  (via drill 0.35)
  Top 0.305: U1.PAD 69.53,14.29 U1.P2 66.98,14.29 66.04,15.24 | v51.44,40.64 51.44,37.48 51.09,37.13 51.09,37.12 50,36.03 IC11.5 | IC4.21 15.56,37.16 15.24,36.83 15.24,35.56 | 15.56,34.61 15.61,34.55 IC4.25 18.15,34.55 18.41,34.29 18.03,33.91 IC4.26 15.62,33.91 | 13.97,39.1 13.6,38.73 | U2.GND1 6.3,36.8 X2.GND | IC11.20 50,28.41 50.16,28.57
  Top 0.406: IC4.18 13.97,39.1 13.71,39.1 | IC4.7 22.54,36.51
  other vias: 58.42,11.43 66.04,50.8 39.37,41.91 41.91,11.43 67.31,46.99 82.55,48.26 63.5,39.37 65.41,16.51 26.67,41.91 33.02,34.29 43.81,50.8 39.37,21.59 27.94,25.4 74.93,45.72 74.93,39.37 15.88,12.06 23.5,16.51 10.16,21.59 8.89,30.48 14.61,32.38 9.53,38.1 52.07,11.43 72.39,6.35 93.34,4.45 7.62,49.53 54.61,22.23 52.7,29.84 48.26,30.48 33.02,30.48 62.87,9.53 65.41,22.86 52.7,20.32
  pour Top (isolate 0.406, rank 2): 0,0 97.79,0 99.06,1.27 99.06,50.8 96.52,53.34 95.25,53.34 0,53.34
  pour Bottom (isolate 0.406, rank 2): 0,0 97.79,0 99.06,1.27 99.06,50.8 96.52,53.34 95.25,53.34 0,53.34
GNDA  (via drill 0.35)
  other vias: 71.12,16.51 76.2,15.24 72.39,35.56 80.01,35.56
  pour Top (isolate 0.406): 99.06,5.71 75.56,5.71 74.93,6.35 70.48,10.79 70.48,20.32 70.48,20.95 69.22,22.23 69.22,36.2 70.48,37.47 83.19,37.47 85.09,39.37 85.09,43.18 87,45.09 99.06,45.09
  pour Bottom (isolate 0.406): 99.06,5.71 75.56,5.71 74.93,6.35 70.48,10.79 70.48,20.32 70.48,20.95 69.22,22.23 69.22,36.2 70.48,37.47 83.19,37.47 85.09,39.37 85.09,43.18 87,45.09 99.06,45.09
N$8  (via drill 0.35)
  Top 0.305: U2.VBUS1 4.58,39.37 2.54,39.37 1.91,38.73 v1.91,36.2
  Top 0.406: X2.VBUS 10.29,36.85 F1.2
  Bottom 0.305: v1.91,36.2 2.51,35.59 2.51,35.54 3.44,34.61 7.36,34.61 8.33,35.58 X2.VBUS
N$9
  Top 0.305: U1.P8 74,14.95 74.42,15.37 SJ1.1
N$10
  Top 0.406: IC3.12 72.39,27.94 C12.+ 73.02,26.25 C13.1 C14.1 80.66,26.25 C15.+ 81.28,27.94 IC3.19
N$11
  Top 0.305: IC4.27 18.82,33.26 19.05,33.02 TP3.TP
N$12
  Top 0.305: IC4.17 11.89,39.76 11.54,40.11 C18.2
N$13
  Top 0.305: IC3.18 80.01,33.02 81.28,34.29 83.19,34.29 83.82,33.66 83.82,21.59 82.23,20 R6.2
N$14
  Top 0.305: TP2.TP 16.7,30.66 IC4.28
N$15
  Top 0.305: IC4.3 25.79,33.91 26.67,33.02 C19.1
N$16
  Top 0.305: IC4.22 18.09,36.51 18.83,37.24 LED6.C
N$17
  Top 0.305: IC4.23 18.71,35.85 19.68,36.83 19.68,41.27 20.32,41.91 | 20.32,41.91 | 20.32,41.91 | 20.32,41.91 | 20.32,41.91 20.32,44.45 19.05,45.72 LED5.C
N$18
  Top 0.305: R9.1 LED6.A
N$19
  Top 0.305: R8.1 15.24,45.72 LED5.A
N$20
  Top 0.305: R7.1 JP1.2
N$21
  Top 0.305: LED3.A 17.46,13.43 R4.1
N$22
  Top 0.305: LED4.A 29.21,42.86 R5.1
N$23
  Top 0.305: R2.1 LED2.A
N$24
  Top 0.305: R1.1 LED1.A
N$25
  Top 0.406: IC3.14 TP4.TP
N$26
  Top 0.305: SJ3.1 31.75,42.86 R5.2
N$27
  Top 0.305: SJ2.1 19.81,13.97 R4.2
N$28  (1 unrouted)
  Top 0.406: U2.USBSHD 3.63,43.51 X2.USBSHD | U2.USBSHD1 3.63,32.69 X2.USBSHD2
  Bottom 0.406: SJ5.2 3.63,47.32 X2.USBSHD
RST  (via drill 0.35)
  Top 0.305: SV7.6 33.02,3.81 34.29,5.08 v34.29,11.43 | v35.56,20.32 35.56,22.86 34.29,24.13 31.75,24.13 30.06,25.82 C19.2 | IC11.31 56.84,30.81 57.78,31.75 58.42,31.75 59.69,30.48 59.69,29.21 60.96,27.94 61.09,27.94 SV1.5
  Top 0.406: R3.1 42.23,15.24 44.45,15.24 45.01,14.68 S1.2
  Bottom 0.305: 35.56,12.7 v35.56,20.32 | v34.29,11.43 35.56,12.7 | 35.56,12.7 35.84,12.98 S1.2 S1.1 53.77,15.24 55.88,15.24 62.23,21.59 62.23,22.86 63.63,24.26 SV1.5
VCAN  (via drill 0.35)
  Top 0.508: X1.9 88.9,20.95 87.63,19.68 84.45,19.68 83.19,18.41 v83.19,10.16 | v27.94,7.62 17.78,7.62 13.97,11.43 v13.97,15.24
  Bottom 0.508: v83.19,10.16 78.11,5.08 67.56,5.08 67.23,4.75 48.59,4.75 45.72,7.62 v27.94,7.62 | v13.97,15.24 13.97,17.78 15.24,19.05 15.24,24.13 13.97,25.4 JP2.3
VCC  (via drill 0.35)
  Top 0.305: C16.2 26.67,35.56 25.66,34.55 IC4.4 21.96,34.55 v21.59,34.92 | R8.2 R9.2 v10.16,43.18 | v50.8,20.32 50.8,20.95 49.2,22.55 IC11.19 49.2,28.88 50.8,30.48 IC11.4
  Top 0.406: 76.2,45.72 IC3.6 76.2,38.73 75.56,38.1 71.12,38.1 69.22,36.2 69.22,31.11 68.58,30.48 SV1.2 | 76.2,45.72 76.2,47.2 C7.+ | C8.1 76.2,45.72 | SJ2.2 v21.59,8.89 | U1.P5 71.4,12.35 71.12,12.06 64.14,12.06 v63.5,12.7 | v57.15,12.7 56.2,13.65 R2.2 R1.2 56.2,19.37 v56.52,19.68 | C10.1 39.47,17.46 R3.2 v41.91,20.32
  Bottom 0.305: v10.16,43.18 11.43,41.91 15.24,41.91 16.51,40.64 20.32,40.64 21.59,39.37 v21.59,34.92 20.32,33.66 20.32,24.13 21.59,22.86 | v41.91,20.32 v50.8,20.32 52.07,19.05 54.61,19.05 55.24,19.68 v56.52,19.68
  Bottom 0.406: v21.59,8.89 21.59,17.78 20.32,19.05 20.32,21.59 21.59,22.86 JP4.2 33.02,22.86 34.29,21.59 36.83,21.59 38.1,20.32 v41.91,20.32 | v63.5,12.7 v57.15,12.7 | SV1.2 64.77,29.08 64.77,27.3 64.14,26.67 62.87,26.67 62.23,26.04 62.23,24.13 57.78,19.68 v56.52,19.68
VEXT
  Top 0.508: IC2.3 4.04,25.42 C2.+ 8.89,27.94 10.16,26.67 10.16,24.13 11.43,22.86 JP2.2
VEXT_5V  (via drill 0.35)
  Top 0.508: IC2.2 IC2.TAB 9.45,18.49 10.16,17.78 16.51,17.78 | 16.51,17.78 17.78,19.05 JP3.1 | C4.+ 16.51,17.57 16.51,17.78
  other vias: 5.08,16.51 6.35,16.51 7.62,16.51 7.62,15.24 6.35,15.24 5.08,15.24
  pour Top (isolate 0.406): 3.81,21.59 3.81,13.97 5.08,12.7 7.62,12.7 8.89,13.97 8.89,21.59 7.62,22.86 5.08,22.86
  pour Bottom (isolate 0.406): 3.81,21.59 3.81,13.97 5.08,12.7 7.62,12.7 8.89,13.97 8.89,21.59 7.62,22.86 5.08,22.86
VIN  (via drill 0.35)
  Top 0.508: v28.57,6.35 17.07,6.35 J1.1
  Bottom 0.508: SV7.1 45.72,5.08 44.45,6.35 v28.57,6.35 | J1.1 11.99,19.61 JP2.1
VUSB
  Top 0.406: C17.2 11.43,32.17 F1.1 12.55,32.87 13.97,34.29 13.97,36.83 14.61,37.47 | IC4.20 14.95,37.8 14.61,37.47 | IC4.19 15.6,38.45 14.61,37.47
  Top 0.508: F1.1 11.58,32.87 12.7,31.75 12.7,30.48 JP3.3
XTAL1
  Top 0.305: C9.2 38.65,31.62 Q1.2 40.77,31.62 41.58,30.81 IC11.10
XTAL2
  Top 0.305: C11.2 36.28,26.8 Q1.1 39.37,29.21 40.17,30.01 IC11.11

### Text on the board
tNames: AREF | GND | 13 | 12 | 11 | 10 | 9 | 8 | 7 | 6 | 5 | 4 | 3 | ~2 | 1 | 0 | ~14 | TX | MOSI | MISO | RX | TX | TX | RX | DAC | RX | CAN | DIGITAL PWM(~) | L | ICSP | VCAN | VUSB | 5V | VIN | EXT | 3.3V | Reset | TX | RX | CAN | POWER | CAN | PWR | INT2 | INT0 | INT1 | ANALOG | SCK | TERM | VIN | IOREF | RST | 3.3V | 5V | GND | GND | VIN | A0 | A1 | A2 | A3 | A4 | A5 | 6 | A7 | A8
bNames: USB shielding / to GND | ATmega64M1 Development Board / (Arduino-Compatible) / / Design: Christoph Jurczyk / Version: V1 Aug 2018 / / License: | For power over CAN close SJ4 / and switch Jumpter to VCAN | GNU Lesser General Public / License v3 (LGPL-3.0) | CAN GND